# Altium schematic sheet ArduinoSchematic.SchDoc
size A4; SheetNumber: 1; SheetTotal: 1
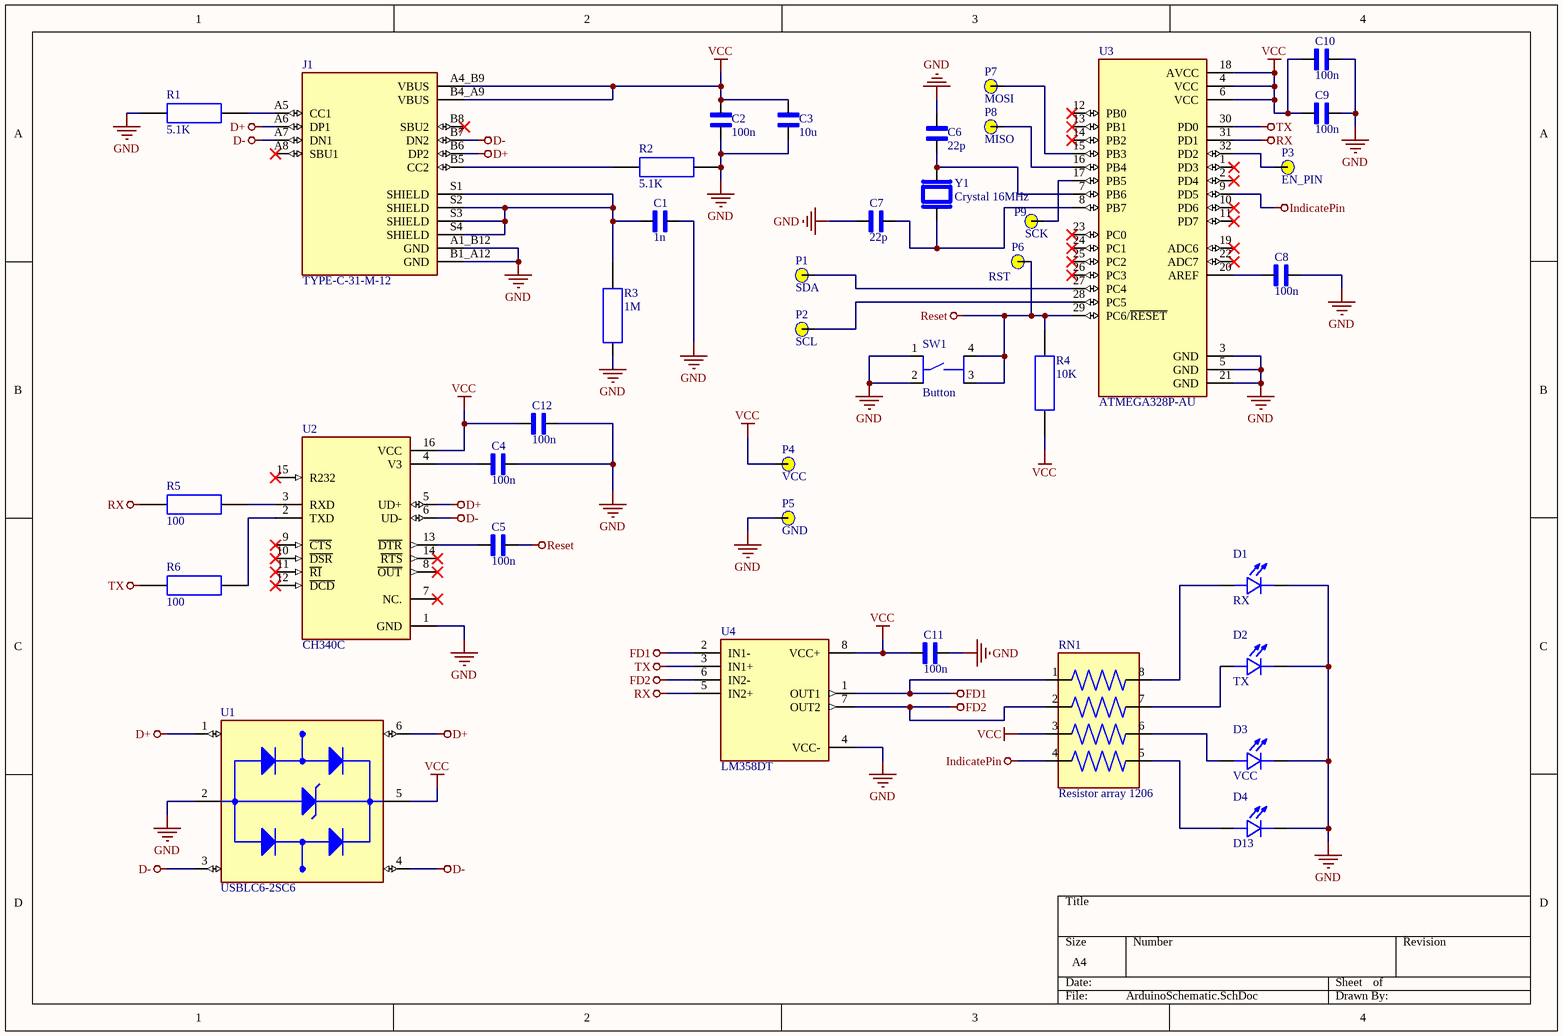
[diagram p0: ArduinoSchematic.SchDoc]

## Parts
C1  1n  [Capacitor 1206]
C2  100n  [Capacitor 1206]
C3  10u  [Capacitor 1206]
C4  100n  [Capacitor 1206]
C5  100n  [Capacitor 1206]
C6  22p  [Capacitor 1206]
C7  22p  [Capacitor 1206]
C8  100n  [Capacitor 1206]
C9  100n  [Capacitor 1206]
C10  100n  [Capacitor 1206]
C11  100n  [Capacitor 1206]
C12  100n  [Capacitor 1206]
D1  RX  [LED 1206]
D2  TX  [LED 1206]
D3  VCC  [LED 1206]
D4  D13  [LED 1206]
J1  TYPE-C-31-M-12  [HRO_TYPE-C-31-M-12]
P1  SDA  [PCB_Pin_1]  (no BOM)
P2  SCL  [PCB_Pin_1]  (no BOM)
P3  EN_PIN  [PCB_Pin_1]  (no BOM)
P4  VCC  [PCB_Pin_1]  (no BOM)
P5  GND  [PCB_Pin_1]  (no BOM)
P6  RST  [PCB_Pin_1]  (no BOM)
P7  MOSI  [PCB_Pin_1]  (no BOM)
P8  MISO  [PCB_Pin_1]  (no BOM)
P9  SCK  [PCB_Pin_1]  (no BOM)
R1  5.1K  [Resistor 1206]
R2  5.1K  [Resistor 1206]
R3  1M  [Resistor 1206]
R4  10K  [Resistor 1206]
R5  100  [Resistor 1206]
R6  100  [Resistor 1206]
RN1  Resistor array 1206  [Resistor array 1206]
SW1  Button  [Button]
U1  USBLC6-2SC6  [USBLC6-2SC6]
U2  CH340C  [CH-340C]
U3  ATMEGA328P-AU  [ATMEGA328P-AU]
U4  LM358DT  [LM358DT]
Y1  Crystal 16MHz  [Crystal 16MHz]

## Nets
D+: J1.A6(DP1) J1.B6(DP2) U1.1(I/O1_IN) U1.6(I/O1_OUT) U2.5(UD+)
D-: J1.A7(DN1) J1.B7(DN2) U1.3(I/O2_IN) U1.4(I/O2_OUT) U2.6(UD-)
FD1: RN1.1 U4.1(OUT1) U4.2(IN1-)
FD2: RN1.2 U4.6(IN2-) U4.7(OUT2)
GND: C1.2 C2.1 C3.1 C4.2 C6.2 C7.2 C8.2 C9.2 C10.2 C11.2 C12.2 D1.C D2.C D3.C D4.C J1.A1_B12(GND) J1.B1_A12(GND) P5.0(Pin) R1.1 R2.2 R3.1 SW1.1 SW1.2 U1.2(GND) U2.1(GND) U3.3(GND) U3.5(GND) U3.21(GND) U4.4(VCC-)
IndicatePin: RN1.4 U3.9(PD5)
Reset: C5.2 P6.0(Pin) R4.2 SW1.3 SW1.4 U3.29(PC6/~{RESET})
RX: R5.1 U3.31(PD1) U4.5(IN2+)
TX: R6.1 U3.30(PD0) U4.3(IN1+)
VCC: C2.2 C3.2 C9.1 C10.1 C11.1 C12.1 J1.A4_B9(VBUS) J1.B4_A9(VBUS) P4.0(Pin) R4.1 RN1.3 U1.5(VBUS) U2.16(VCC) U3.4(VCC) U3.6(VCC) U3.18(AVCC) U4.8(VCC+)
NetC1_1: C1.1 J1.S1(SHIELD) J1.S2(SHIELD) J1.S3(SHIELD) J1.S4(SHIELD) R3.2
NetC4_1: C4.1 U2.4(V3)
NetC5_1: C5.1 U2.13(~{DTR})
NetC6_1: C6.1 U3.7(PB6) Y1.2
NetC7_1: C7.1 U3.8(PB7) Y1.1
NetC8_1: C8.1 U3.20(AREF)
NetD1_A: D1.A RN1.8
NetD2_A: D2.A RN1.7
NetD3_A: D3.A RN1.6
NetD4_A: D4.A RN1.5
NetJ1_A5: J1.A5(CC1) R1.2
NetJ1_B5: J1.B5(CC2) R2.1
NetP1_0: P1.0(Pin) U3.27(PC4)
NetP2_0: P2.0(Pin) U3.28(PC5)
NetP3_0: P3.0(Pin) U3.32(PD2)
NetP7_0: P7.0(Pin) U3.15(PB3)
NetP8_0: P8.0(Pin) U3.16(PB4)
NetP9_0: P9.0(Pin) U3.17(PB5)
NetR5_2: R5.2 U2.3(RXD)
NetR6_2: R6.2 U2.2(TXD)

Not connected (* = marked no-connect by the designer): J1 A8(SBU1)* B8(SBU2)*; U2 7(NC.)* 8(~{OUT})* 9(~{CTS})* 10(~{DSR})* 11(~{RI})* 12(~{DCD})* 14(~{RTS})* 15(R232)*; U3 1(PD3)* 2(PD4)* 10(PD6)* 11(PD7)* 12(PB0)* 13(PB1)* 14(PB2)* 19(ADC6)* 22(ADC7)* 23(PC0)* 24(PC1)* 25(PC2)* 26(PC3)*

## Library data of the parts
C1-C12 = Capacitor 1206: MF: AVX; MP: 12061C225K4T2A; SnapEDA_Link: https://www.snapeda.com/parts/12061C225K4T2A/AVX/view-part/?ref=snap; Package: 3216 AVX; Value: *; Check_prices: https://www.snapeda.com/parts/12061C225K4T2A/AVX/view-part/?ref=eda
D1-D4 = LED 1206: MF: Lite-On Inc.; MP: LTST-C230KGKT; SnapEDA_Link: https://www.snapeda.com/parts/LTST-C230KGKT/Lite-On/view-part/?ref=snap; Package: 1206 Lite-On; Value: *; Check_prices: https://www.snapeda.com/parts/LTST-C230KGKT/Lite-On/view-part/?ref=eda
J1 = TYPE-C-31-M-12: USB Connectors 24 Receptacle 1 8.94*7.3mm RoHS; MF: HRO Electronics Co., Ltd.; SnapEDA_Link: https://www.snapeda.com/parts/TYPE-C-31-M-12/HRO+Electronics+Co.%252C+Ltd./view-part/?ref=snap; Package: Package; Value: *; MP: TYPE-C-31-M-12; Check_prices: https://www.snapeda.com/parts/TYPE-C-31-M-12/HRO+Electronics+Co.%252C+Ltd./view-part/?ref=eda
P1-P9 = PIN_1
R1-R6 = Resistor 1206: MP: ERJU08F4703V; Package: None; Price: None; Availability: Unavailable; Value: *
RN1 = Resistor array 1206: Resistor,Thick Film,Networks & Arrays,330 Ohm,5%,8 Pin | Bourns CAY16-331J4LF; SnapEDA_Link: https://www.snapeda.com/parts/CAY16-331J4LF/Bourns/view-part/?ref=snap; Package: NON STANDARD-8 Bourns; Value: *; MF: Bourns; MP: CAY16-331J4LF; Check_prices: https://www.snapeda.com/parts/CAY16-331J4LF/Bourns/view-part/?ref=eda
SW1 = Button: Tactile Switch SPST-NO Top Actuated Through Hole; MF: TE Connectivity ALCOSWITCH Switches; MP: 1-1825910-4; SnapEDA_Link: https://www.snapeda.com/parts/1-1825910-4/TE+Connectivity+Alcoswitch+Switches/view-part/?ref=snap; Package: None; Value: *; Check_prices: https://www.snapeda.com/parts/1-1825910-4/TE+Connectivity+Alcoswitch+Switches/view-part/?ref=eda
U1 = USBLC6-2SC6: 17V Clamp 5A (8/20Âµs) Ipp Tvs Diode Surface Mount SOT-23-6; MF: STMicroelectronics; Value: *; SnapEDA_Link: https://www.snapeda.com/parts/USBLC6-2SC6/STMicroelectronics/view-part/?ref=snap; Check_prices: https://www.snapeda.com/parts/USBLC6-2SC6/STMicroelectronics/view-part/?ref=eda; Purchase-URL: https://pricing.snapeda.com/search/part/USBLC6-2SC6/?ref=eda; Price: None; Availability: In Stock; Package: SOT-23-6 STMicroelectronics; MP: USBLC6-2SC6
U2 = CH340C: USB to serial chip CH340; MF: WCH; Price: None; Availability: Not in stock; MP: CH340C; Package: None; SnapEDA_Link: https://www.snapeda.com/parts/CH340C/WCH/view-part/?ref=snap; Check_prices: https://www.snapeda.com/parts/CH340C/WCH/view-part/?ref=eda; Value: *
U3 = ATMEGA328P-AU: MICROCONTROLLER MCU, 8 BIT, ATMEGA, 20MH; MICROCONTROLLER MCU, 8 BIT, ATMEGA, 20MHZ, TQFP-32; Controller Family/Series:ATmega; CPU Speed:20MHz; Program Memory Size:32KB; RAM Memory Size:2KB; No. of Pins:32Pins; MCU Case Style:TQFP; No. of I/O's:23I/O's; P; MF: Microchip Technology; MP: ATMEGA328PAU; SnapEDA_Link: https://www.snapeda.com/parts/ATMEGA328PAU/Microchip+Technology/view-part/?ref=snap; Package: None; Value: *; Check_prices: https://www.snapeda.com/parts/ATMEGA328PAU/Microchip+Technology/view-part/?ref=eda
U4 = LM358DT: MF: STMicroelectronics; Price: None; Package: SOIC-8 STMicroelectronics; MP: LM358DT; Value: *; Availability: Unavailable; SnapEDA_Link: https://www.snapeda.com/parts/LM358DT/STMicroelectronics/view-part/6634/?ref=snap
Y1 = Crystal 16MHz: Quartz Crystal, HC-49/U-S Short Package; MF: Aker Technology; MP: CA-3.6864-18-3050-X; SnapEDA_Link: https://www.snapeda.com/parts/CA-3.6864-18-3050-X/Aker/view-part/?ref=snap; Package: None; Value: *; Check_prices: https://www.snapeda.com/parts/CA-3.6864-18-3050-X/Aker/view-part/?ref=eda